# Altium schematic sheet Ethernet_Switch.SchDoc: =project_title
size Tabloid; CompanyName: Luxonis Holding; DrawnBy: Dan Dunga; Organization: Luxonis Holding; Address1: 1925 Harmony Park Drive; Address2: Westminster, CO; Address3: 80234; Address4: United States; SheetNumber: 8; SheetTotal: 15
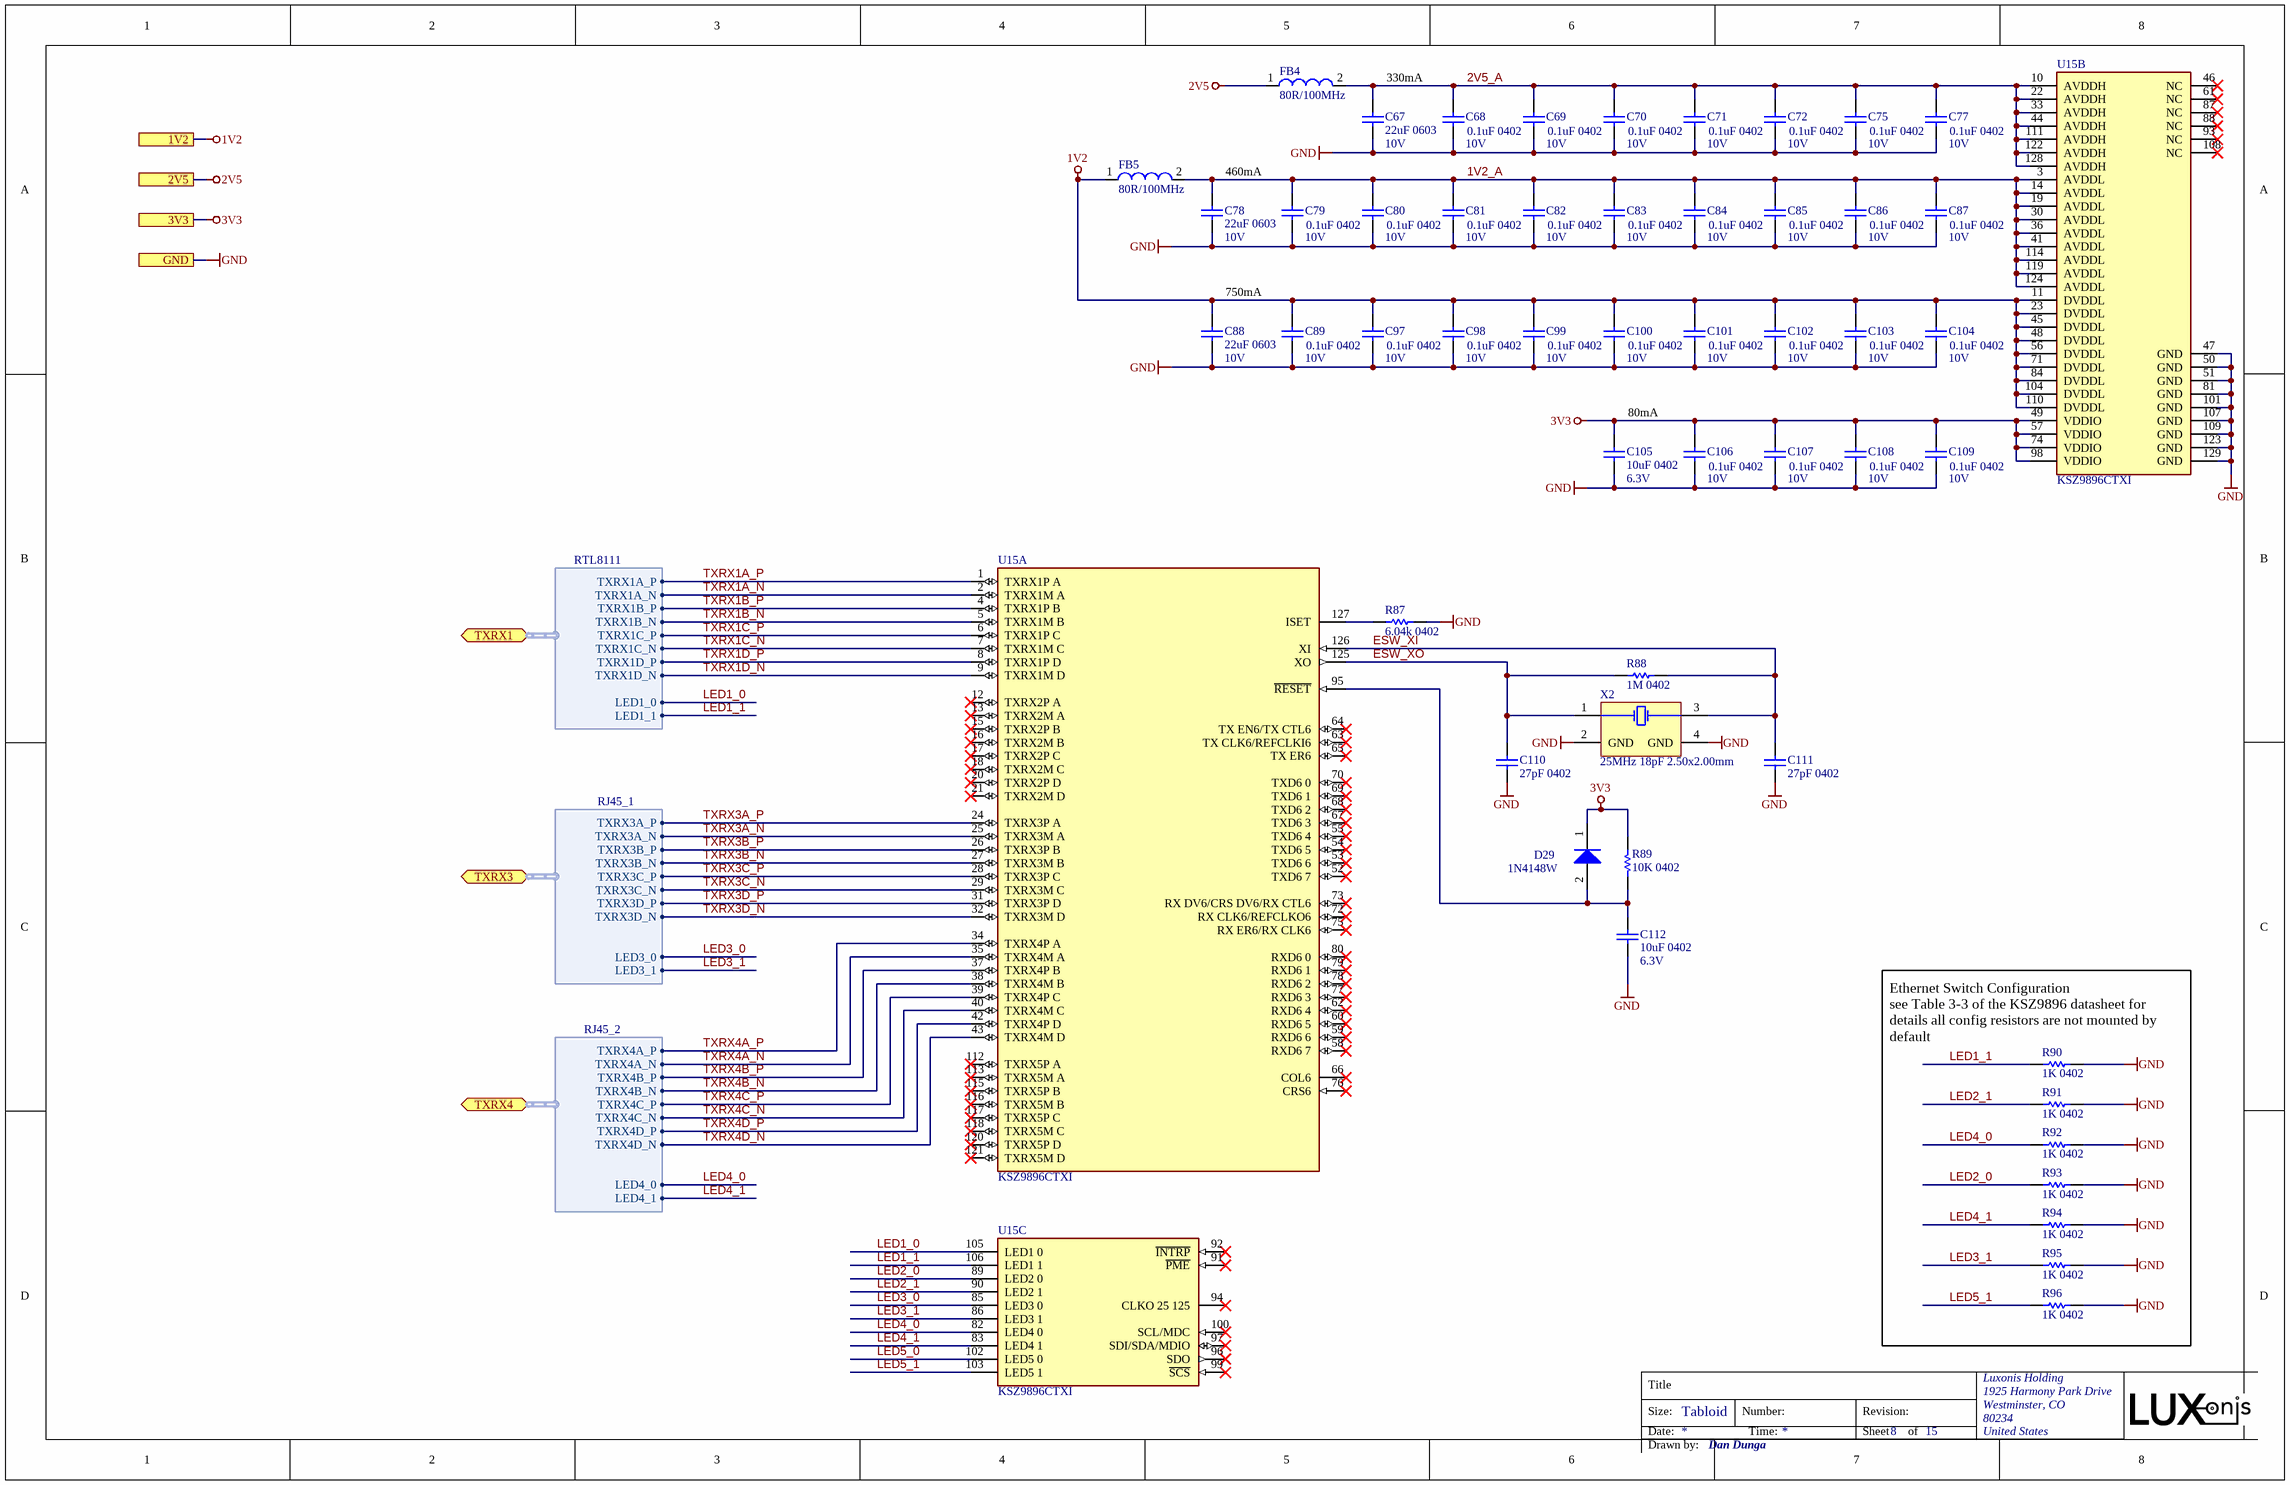
[diagram p0: Ethernet_Switch.SchDoc]

## Parts
C67  22uF 0603  Voltage Rating: 10V  [CAPC0603(1608)100_N]
C68  0.1uF 0402  Voltage Rating: 10V  [CAPC0402(1005)70_N]
C69  0.1uF 0402  Voltage Rating: 10V  [CAPC0402(1005)70_N]
C70  0.1uF 0402  Voltage Rating: 10V  [CAPC0402(1005)70_N]
C71  0.1uF 0402  Voltage Rating: 10V  [CAPC0402(1005)70_N]
C72  0.1uF 0402  Voltage Rating: 10V  [CAPC0402(1005)70_N]
C75  0.1uF 0402  Voltage Rating: 10V  [CAPC0402(1005)70_N]
C77  0.1uF 0402  Voltage Rating: 10V  [CAPC0402(1005)70_N]
C78  22uF 0603  Voltage Rating: 10V  [CAPC0603(1608)100_N]
C79  0.1uF 0402  Voltage Rating: 10V  [CAPC0402(1005)70_N]
C80  0.1uF 0402  Voltage Rating: 10V  [CAPC0402(1005)70_N]
C81  0.1uF 0402  Voltage Rating: 10V  [CAPC0402(1005)70_N]
C82  0.1uF 0402  Voltage Rating: 10V  [CAPC0402(1005)70_N]
C83  0.1uF 0402  Voltage Rating: 10V  [CAPC0402(1005)70_N]
C84  0.1uF 0402  Voltage Rating: 10V  [CAPC0402(1005)70_N]
C85  0.1uF 0402  Voltage Rating: 10V  [CAPC0402(1005)70_N]
C86  0.1uF 0402  Voltage Rating: 10V  [CAPC0402(1005)70_N]
C87  0.1uF 0402  Voltage Rating: 10V  [CAPC0402(1005)70_N]
C88  22uF 0603  Voltage Rating: 10V  [CAPC0603(1608)100_N]
C89  0.1uF 0402  Voltage Rating: 10V  [CAPC0402(1005)70_N]
C97  0.1uF 0402  Voltage Rating: 10V  [CAPC0402(1005)70_N]
C98  0.1uF 0402  Voltage Rating: 10V  [CAPC0402(1005)70_N]
C99  0.1uF 0402  Voltage Rating: 10V  [CAPC0402(1005)70_N]
C100  0.1uF 0402  Voltage Rating: 10V  [CAPC0402(1005)70_N]
C101  0.1uF 0402  Voltage Rating: 10V  [CAPC0402(1005)70_N]
C102  0.1uF 0402  Voltage Rating: 10V  [CAPC0402(1005)70_N]
C103  0.1uF 0402  Voltage Rating: 10V  [CAPC0402(1005)70_N]
C104  0.1uF 0402  Voltage Rating: 10V  [CAPC0402(1005)70_N]
C105  10uF 0402  Voltage Rating: 6.3V  [CAPC0402(1005)70_N]
C106  0.1uF 0402  Voltage Rating: 10V  [CAPC0402(1005)70_N]
C107  0.1uF 0402  Voltage Rating: 10V  [CAPC0402(1005)70_N]
C108  0.1uF 0402  Voltage Rating: 10V  [CAPC0402(1005)70_N]
C109  0.1uF 0402  Voltage Rating: 10V  [CAPC0402(1005)70_N]
C110  27pF 0402  [CAPC0402(1005)60_N]
C111  27pF 0402  [CAPC0402(1005)60_N]
C112  10uF 0402  Voltage Rating: 6.3V  [CAPC0402(1005)70_N]
D29  1N4148W  [1N4148W-7-F]
FB4  80R/100MHz  [BK1608HS800-T_N]
FB5  80R/100MHz  [BK1608HS800-T_N]
R87  6.04k 0402  [RESC0402(1005)_L]
R88  1M 0402  [RESC0402(1005)_N]
R89  10K 0402  [RESC0402(1005)_N]
R90  1K 0402  [RESC0402(1005)_N]
R91  1K 0402  [RESC0402(1005)_N]
R92  1K 0402  [RESC0402(1005)_N]
R93  1K 0402  [RESC0402(1005)_N]
R94  1K 0402  [RESC0402(1005)_N]
R95  1K 0402  [RESC0402(1005)_N]
R96  1K 0402  [RESC0402(1005)_N]
U15  KSZ9896CTXI  [FP-C04-418-IPC_A]  (parts A,B,C of 3)
X2  25MHz 18pF 2.50x2.00mm  [ECS-250-18-36B-CKY-TR]

## Ports
1V2, 2V5, 3V3, GND, TXRX1 (bidir, harness RTL8111), TXRX3 (bidir, harness RJ45_1), TXRX4 (bidir, harness RJ45_2)

## Harnesses
RTL8111: TXRX1A_P, TXRX1A_N, TXRX1B_P, TXRX1B_N, TXRX1C_P, TXRX1C_N, TXRX1D_P, TXRX1D_N, LED1_0, LED1_1
RJ45_1: TXRX3A_P, TXRX3A_N, TXRX3B_P, TXRX3B_N, TXRX3C_P, TXRX3C_N, TXRX3D_P, TXRX3D_N, LED3_0, LED3_1
RJ45_2: TXRX4A_P, TXRX4A_N, TXRX4B_P, TXRX4B_N, TXRX4C_P, TXRX4C_N, TXRX4D_P, TXRX4D_N, LED4_0, LED4_1

## Nets
1V2: C88.2 C89.2 C97.2 C98.2 C99.2 C100.2 C101.2 C102.2 C103.2 C104.2 FB5.1 U15.11(DVDDL) U15.23(DVDDL) U15.45(DVDDL) U15.48(DVDDL) U15.56(DVDDL) U15.71(DVDDL) U15.84(DVDDL) U15.104(DVDDL) U15.110(DVDDL) ; port 1V2
2V5: FB4.1 ; port 2V5
3V3: C105.2 C106.2 C107.2 C108.2 C109.2 D29.1(K) R89.1 U15.49(VDDIO) U15.57(VDDIO) U15.74(VDDIO) U15.98(VDDIO) ; port 3V3
GND: C67.1 C68.1 C69.1 C70.1 C71.1 C72.1 C75.1 C77.1 C78.1 C79.1 C80.1 C81.1 C82.1 C83.1 C84.1 C85.1 C86.1 C87.1 C88.1 C89.1 C97.1 C98.1 C99.1 C100.1 C101.1 C102.1 C103.1 C104.1 C105.1 C106.1 C107.1 C108.1 C109.1 C110.1 C111.1 C112.1 R87.2 R90.1 R91.1 R92.1 R93.1 R94.1 R95.1 R96.1 U15.47(GND) U15.50(GND) U15.51(GND) U15.81(GND) U15.101(GND) U15.107(GND) U15.109(GND) U15.123(GND) U15.129(GND) X2.2(GND) X2.4(GND) ; port GND
1V2_A: C78.2 C79.2 C80.2 C81.2 C82.2 C83.2 C84.2 C85.2 C86.2 C87.2 FB5.2 U15.3(AVDDL) U15.14(AVDDL) U15.19(AVDDL) U15.30(AVDDL) U15.36(AVDDL) U15.41(AVDDL) U15.114(AVDDL) U15.119(AVDDL) U15.124(AVDDL)
2V5_A: C67.2 C68.2 C69.2 C70.2 C71.2 C72.2 C75.2 C77.2 FB4.2 U15.10(AVDDH) U15.22(AVDDH) U15.33(AVDDH) U15.44(AVDDH) U15.111(AVDDH) U15.122(AVDDH) U15.128(AVDDH)
ESW_XI: C111.2 R88.2 U15.126(XI) X2.3(X2)
ESW_XO: C110.2 R88.1 U15.125(XO) X2.1(X1)
LED1_0: U15.105(LED1_0) ; port TXRX1.LED1_0
LED1_1: R90.2 U15.106(LED1_1) ; port TXRX1.LED1_1
LED2_0: R93.2 U15.89(LED2_0)
LED2_1: R91.2 U15.90(LED2_1)
LED3_0: U15.85(LED3_0) ; port TXRX3.LED3_0
LED3_1: R95.2 U15.86(LED3_1) ; port TXRX3.LED3_1
LED4_0: R92.2 U15.82(LED4_0) ; port TXRX4.LED4_0
LED4_1: R94.2 U15.83(LED4_1) ; port TXRX4.LED4_1
LED5_0: U15.102(LED5_0)
LED5_1: R96.2 U15.103(LED5_1)
TXRX1A_N: U15.2(TXRX1M_A) ; port TXRX1.TXRX1A_N
TXRX1A_P: U15.1(TXRX1P_A) ; port TXRX1.TXRX1A_P
TXRX1B_N: U15.5(TXRX1M_B) ; port TXRX1.TXRX1B_N
TXRX1B_P: U15.4(TXRX1P_B) ; port TXRX1.TXRX1B_P
TXRX1C_N: U15.7(TXRX1M_C) ; port TXRX1.TXRX1C_N
TXRX1C_P: U15.6(TXRX1P_C) ; port TXRX1.TXRX1C_P
TXRX1D_N: U15.9(TXRX1M_D) ; port TXRX1.TXRX1D_N
TXRX1D_P: U15.8(TXRX1P_D) ; port TXRX1.TXRX1D_P
TXRX3A_N: U15.25(TXRX3M_A) ; port TXRX3.TXRX3A_N
TXRX3A_P: U15.24(TXRX3P_A) ; port TXRX3.TXRX3A_P
TXRX3B_N: U15.27(TXRX3M_B) ; port TXRX3.TXRX3B_N
TXRX3B_P: U15.26(TXRX3P_B) ; port TXRX3.TXRX3B_P
TXRX3C_N: U15.29(TXRX3M_C) ; port TXRX3.TXRX3C_N
TXRX3C_P: U15.28(TXRX3P_C) ; port TXRX3.TXRX3C_P
TXRX3D_N: U15.32(TXRX3M_D) ; port TXRX3.TXRX3D_N
TXRX3D_P: U15.31(TXRX3P_D) ; port TXRX3.TXRX3D_P
TXRX4A_N: U15.35(TXRX4M_A) ; port TXRX4.TXRX4A_N
TXRX4A_P: U15.34(TXRX4P_A) ; port TXRX4.TXRX4A_P
TXRX4B_N: U15.38(TXRX4M_B) ; port TXRX4.TXRX4B_N
TXRX4B_P: U15.37(TXRX4P_B) ; port TXRX4.TXRX4B_P
TXRX4C_N: U15.40(TXRX4M_C) ; port TXRX4.TXRX4C_N
TXRX4C_P: U15.39(TXRX4P_C) ; port TXRX4.TXRX4C_P
TXRX4D_N: U15.43(TXRX4M_D) ; port TXRX4.TXRX4D_N
TXRX4D_P: U15.42(TXRX4P_D) ; port TXRX4.TXRX4D_P
NetC112_2: C112.2 D29.2(A) R89.2 U15.95(~{RESET})
NetR87_1: R87.1 U15.127(ISET)

Not connected (* = marked no-connect by the designer): U15 12(TXRX2P_A)* 13(TXRX2M_A)* 15(TXRX2P_B)* 16(TXRX2M_B)* 17(TXRX2P_C)* 18(TXRX2M_C)* 20(TXRX2P_D)* 21(TXRX2M_D)* 46(NC)* 52(TXD6_7)* 53(TXD6_6)* 54(TXD6_5)* 55(TXD6_4)* 58(RXD6_7)* 59(RXD6_6)* 60(RXD6_5)* 61(NC)* 62(RXD6_4)* 63(TX_CLK6/REFCLKI6)* 64(TX_EN6/TX_CTL6)* 65(TX_ER6)* 66(COL6)* 67(TXD6_3)* 68(TXD6_2)* 69(TXD6_1)* 70(TXD6_0)* 72(RX_CLK6/REFCLKO6)* 73(RX_DV6/CRS_DV6/RX_CTL6)* 75(RX_ER6/RX_CLK6)* 76(CRS6)* 77(RXD6_3)* 78(RXD6_2)* 79(RXD6_1)* 80(RXD6_0)* 87(NC)* 88(NC)* 91(~{PME})* 92(~{INTRP})* 93(NC)* 94(CLKO_25_125)* 96(SDO)* 97(SDI/SDA/MDIO)* 99(~{SCS})* 100(SCL/MDC)* 108(NC)* 112(TXRX5P_A)* 113(TXRX5M_A)* 115(TXRX5P_B)* 116(TXRX5M_B)* 117(TXRX5P_C)* 118(TXRX5M_C)* 120(TXRX5P_D)* 121(TXRX5M_D)*

## Notes on the sheet
- 330mA
- 460mA
- 750mA
- (near C105) 80mA
- (near R90) Ethernet Switch Configuration
  see Table 3-3 of the KSZ9896 datasheet for details all config resistors are not mounted by default
- Title
- Size:
- Date:
- Tabloid
- Number:
- Time:
- Revision:
- Sheet
- of
- Drawn by:

## Library data of the parts
C67 C78 C88 = GRM188R61A226ME15D: CAP CER 22UF 10V X5R 0603 20%; Manufacturer 1: Murata; Material: Ceramic; ComponentLink1URL: https://datasheet.ciiva.com/46444/1769893-46444975.pdf?src-supplier=Element14; ComponentLink1Description: https://datasheet.ciiva.com/46444/1769893-46444975.pdf?src-supplier=Element14; Supplier 1: Digi-Key; Manufacturer Part Number 1: GRM188R61A226ME15D; Stock 1: 984716; Pricing 1: 1=0.31000, 10=0.21500, 100=0.12160, 500=0.08584, 1000=0.07512 (USD); RoHS: Yes; Mount: Surface Mount; Case/Package: 0603; Weight: 0.000222oz; Case Code (Metric): 1608; Case Code (Imperial): 0603; Min Operating Temperature: -55°C; Max Operating Temperature: 85°C; Capacitance: 22uF; Tolerance: 20%; Packaging: Tape and Reel; Dielectric: X5R; Voltage Rating (DC): 10V; Termination: SMD/SMT; Package Quantity: 4000; Length: 1.6mm; Height: 0.8mm; Width: 0.8mm; Thickness: 0.039inch; Depth: 0.8mm; REACH SVHC: No SVHC; Lead Free: Lead Free; Supplier Part Number 1: 490-10476-1-ND
C68-C72 C75 C77 C79-C87 C89 C97-C104 C106-C109 = GRM155R71A104JA01D: CAP CER 0.1UF 10V X7R 0402 5%; Manufacturer 1: Murata; Capacitance: 100nF; Supplier 1: Digi-Key; Manufacturer Part Number 1: GRM155R71A104JA01D; Stock 1: 1346709; Pricing 1: 1=0.10000, 10=0.02500, 100=0.01130, 500=0.00806, 1000=0.00633, 2500=0.00575, 5000=0.00529 (USD); RoHS: Yes; Mount: Surface Mount; Case/Package: 0402; Case Code (Imperial): 0402; Case Code (Metric): 1005; Min Operating Temperature: -55°C; Max Operating Temperature: 125°C; Tolerance: 5%; Packaging: Tape and Reel; Voltage Rating (DC): 10V; Dielectric: X7R; Package Quantity: 10000; Termination: SMD/SMT; Length: 1mm; Height: 0.5mm; Width: 0.02inch; Thickness: 0.022inch; Depth: 0.5mm; Radiation Hardening: No; Lead Free: Lead Free; ComponentLink1URL: https://datasheet.ciiva.com/5411/product-5411135.pdf?src-supplier=Mouser; ComponentLink1Description: https://datasheet.ciiva.com/5411/product-5411135.pdf?src-supplier=Mouser; ComponentLink2URL: https://datasheet.ciiva.com/11618/c02e-11618821.pdf?src-supplier=Avnet; ComponentLink2Description: https://datasheet.ciiva.com/11618/c02e-11618821.pdf?src-supplier=Avnet; Supplier Part Number 1: 490-10777-1-ND
C105 C112 = GRM155R60J106ME15D: CAP CER 10UF 6.3V X5R 0402 20%; Manufacturer 1: Murata; Supplier 1: Digi-Key; Manufacturer Part Number 1: GRM155R60J106ME15D; Stock 1: 1839627; Pricing 1: 1=0.23000, 10=0.15700, 100=0.07950, 500=0.05442, 1000=0.04814, 2500=0.04605, 5000=0.04186 (USD); RoHS: Yes; Mount: Surface Mount; Case/Package: 0402; Case Code (Metric): 1005; Case Code (Imperial): 0402; Min Operating Temperature: -55°C; Max Operating Temperature: 85°C; Packaging: Tape and Reel; Capacitance: 10uF; Dielectric: X5R; Length: 0.039inch; Width: 0.02inch; ComponentLink1URL: https://www.murata.com/~/media/webrenewal/support/library/catalog/products/capacitor/mlcc/c02e.ashx?la=en-us&src-supplier=Digi-Key; ComponentLink1Description: https://www.murata.com/~/media/webrenewal/support/library/catalog/products/capacitor/mlcc/c02e.ashx?la=en-us&src-supplier=Digi-Key; Supplier Part Number 1: 490-13238-1-ND; Voltage Rating (DC): 6.3V; Thickness: 0.026inch; Tolerance: 20%
C110 C111 = C0402C270J5GACTU: CAP CER 27PF 50V C0G/NP0 0402; Manufacturer 1: KEMET; Dielectric Material: Ceramic; Tolerance: 5%; Dielectric: C0G; Temperature Coefficient: 30ppm/°C; Supplier 1: Digi-Key; Manufacturer Part Number 1: C0402C270J5GACTU; RoHS: Yes; Category: Ceramic Capacitors; Stock 1: 1799770; Pricing 1: 1=0.10000, 10=0.03500, 100=0.01580, 500=0.01128, 1000=0.00886, 2500=0.00805, 5000=0.00741 (USD); Mount: Surface Mount,PCB; Case/Package: 0402; Number of Pins: 2; Weight: 2.3E-05oz; Case Code (Metric): 1005; Case Code (Imperial): 0402; Contact Plating: Tin,Matte; Min Operating Temperature: -55°C; Max Operating Temperature: 125°C; Capacitance: 27pF; Packaging: Tape and Reel; Voltage Rating (DC): 50V; Package Quantity: 1; Termination: SMD/SMT; Voltage Rating: 50V; Voltage: 50V; Length: 1mm; Height: 0.5mm; Width: 0.5mm; Depth: 0.5mm; Thickness: 0.022inch; Radiation Hardening: No; Lead Free: Lead Free; REACH SVHC: No SVHC; ComponentLink1URL: https://datasheet.ciiva.com/144/docfinderpartnumber-c0402c270j5gactu-144118.pdf?src-supplier=Digi-Key; ComponentLink1Description: https://datasheet.ciiva.com/144/docfinderpartnumber-c0402c270j5gactu-144118.pdf?src-supplier=Digi-Key; ComponentLink2URL: https://datasheet.ciiva.com/7747/kem-c1003-c0g-smd-7747509.pdf?src-supplier=Element14; ComponentLink2Description: https://datasheet.ciiva.com/7747/kem-c1003-c0g-smd-7747509.pdf?src-supplier=Element14; ComponentLink3URL: https://datasheet.ciiva.com/26847/getdatasheetpartid-408632-26847386.pdf?src-supplier=Verical; ComponentLink3Description: https://datasheet.ciiva.com/26847/getdatasheetpartid-408632-26847386.pdf?src-supplier=Verical; ComponentLink4URL: https://datasheet.ciiva.com/7392/1372242-7392237.pdf?src-supplier=Newark; ComponentLink4Description: https://datasheet.ciiva.com/7392/1372242-7392237.pdf?src-supplier=Newark; ComponentLink5URL: https://datasheet.ciiva.com/14586/70095383-14586671.pdf?src-supplier=Allied+Electronics; ComponentLink5Description: https://datasheet.ciiva.com/14586/70095383-14586671.pdf?src-supplier=Allied+Electronics; Supplier 2: Newark; Supplier 3: Mouser; Supplier Part Number 1: 399-1016-1-ND; Supplier Part Number 2: 53M7161; Supplier Part Number 3: 80-C0402C270J5G
D29 = 1N4148W-7-F: DIODE GEN PURP 100V 300MA SOD123; Manufacturer 1: Diodes; Element Configuration: Single; Forward Current: 150mA; Forward Voltage: 1.25V; Reverse Recovery Time: 4ns; Peak Non-Repetitive Surge Current: 2A; Peak Reverse Current: 1uA; Power Dissipation: 400mW; Polarity: Standard; Voltage Rating (DC): 75V; Capacitance: 2pF; Current: 15A; Supplier 1: Digi-Key; Manufacturer Part Number 1: 1N4148W-7-F; Stock 1: 5430248; Pricing 1: 1=0.16000, 10=0.15000, 100=0.06290, 500=0.04942, 1000=0.03432 (USD); RoHS: Yes; Mount: Surface Mount; Number of Pins: 2; Weight: 0.000353oz; Contact Plating: Tin,Matte; Min Operating Temperature: -65°C; Max Operating Temperature: 150°C; Packaging: Tape and Reel; Package Quantity: 3000; Max Repetitive Reverse Voltage (Vrrm): 100V; Recovery Time: 4ns; Average Rectified Current: 300mA; Max Reverse Voltage (DC): 100V; Max Surge Current: 2A; Max Forward Surge Current (Ifsm): 2A; Power Rating: 400mW; Current Rating: 150mA; Output Current: 150mA; Voltage: 100V; Length: 2.85mm; Height: 1.25mm; Width: 1.7mm; Radiation Hardening: No; Lead Free: Lead Free; REACH SVHC: No SVHC; ComponentLink1URL: https://datasheet.ciiva.com/4435/ds30086-4435128.pdf?src-supplier=Mouser; ComponentLink1Description: https://datasheet.ciiva.com/4435/ds30086-4435128.pdf?src-supplier=Mouser; ComponentLink2URL: https://datasheet.ciiva.com/8300/ds30086-8300392.pdf?src-supplier=Avnet; ComponentLink2Description: https://datasheet.ciiva.com/8300/ds30086-8300392.pdf?src-supplier=Avnet; ComponentLink3URL: https://datasheet.ciiva.com/911/ds30086-911734.pdf?src-supplier=Digi-Key; ComponentLink3Description: https://datasheet.ciiva.com/911/ds30086-911734.pdf?src-supplier=Digi-Key; ComponentLink4URL: https://datasheet.ciiva.com/911/ds30086-911735.pdf?src-supplier=Digi-Key; ComponentLink4Description: https://datasheet.ciiva.com/911/ds30086-911735.pdf?src-supplier=Digi-Key; ComponentLink5URL: https://datasheet.ciiva.com/22695/1915529-22695239.pdf?src-supplier=Element14; ComponentLink5Description: https://datasheet.ciiva.com/22695/1915529-22695239.pdf?src-supplier=Element14; ComponentLink6URL: https://datasheet.ciiva.com/911/ds30086-911736.pdf?src-supplier=Digi-Key; ComponentLink6Description: https://datasheet.ciiva.com/911/ds30086-911736.pdf?src-supplier=Digi-Key; ComponentLink7URL: https://datasheet.ciiva.com/1179/1915529-1179304.pdf?src-supplier=Element14; ComponentLink7Description: https://datasheet.ciiva.com/1179/1915529-1179304.pdf?src-supplier=Element14; ComponentLink8URL: https://datasheet.ciiva.com/25919/ds30086-25919609.pdf?src-supplier=Avnet+Europe; ComponentLink8Description: https://datasheet.ciiva.com/25919/ds30086-25919609.pdf?src-supplier=Avnet+Europe; ComponentLink9URL: https://datasheet.ciiva.com/15219/getdatasheetpartid-110030-15219548.pdf?src-supplier=Verical; ComponentLink9Description: https://datasheet.ciiva.com/15219/getdatasheetpartid-110030-15219548.pdf?src-supplier=Verical; ComponentLink10URL: https://datasheet.ciiva.com/8303/ds30086-8303197.pdf?src-supplier=Avnet; ComponentLink10Description: https://datasheet.ciiva.com/8303/ds30086-8303197.pdf?src-supplier=Avnet; Supplier 2: Newark; Supplier 3: Mouser; Supplier Part Number 1: 1N4148W-FDICT-ND; Supplier Part Number 2: 52R3924; Supplier Part Number 3: 621-1N4148W-F
FB4 FB5 = BK1608HS800-T: FERRITE BEAD 80 OHM 0603 1LN; Manufacturer 1: Taiyo Yuden; Impedance: 80R; Tolerance: 25%; Max DC Current: 600mA; DC Resistance (DCR): 100mR; Test Frequency: 100MHz; Number of Lines: 1; Shielding: Shielded; Supplier 1: Digi-Key; Manufacturer Part Number 1: BK1608HS800-T; Stock 1: 6285; Pricing 1: 1=0.10000, 10=0.07900, 25=0.07200, 50=0.06480, 100=0.04760, 250=0.03460, 500=0.03170, 1000=0.02738 (USD); RoHS: Yes; Mount: Surface Mount; Case/Package: 0603; Number of Pins: 2; Core Material: Ferrite; Case Code (Metric): 1608; Case Code (Imperial): 0603; Min Operating Temperature: -55°C; Max Operating Temperature: 125°C; Package Quantity: 1; Packaging: Tape and Reel; Termination: SMD/SMT; Max Current Rating: 600mA; Frequency: 100MHz; Length: 0.063inch; Height: 0.037inch; Width: 0.8mm; Depth: 0.95mm; REACH SVHC: Unknown; Lead Free: Lead Free; Halogen Free: Halogen Free; ComponentLink1URL: https://datasheet.ciiva.com/1011/bk1608hs800-t-ss-1011885.pdf?src-supplier=Digi-Key; ComponentLink1Description: https://datasheet.ciiva.com/1011/bk1608hs800-t-ss-1011885.pdf?src-supplier=Digi-Key; ComponentLink2URL: https://datasheet.ciiva.com/1011/mlci07-e-1011886.pdf?src-supplier=Digi-Key; ComponentLink2Description: https://datasheet.ciiva.com/1011/mlci07-e-1011886.pdf?src-supplier=Digi-Key; ComponentLink3URL: https://datasheet.ciiva.com/1011/mlci07-e-1011887.pdf?src-supplier=Digi-Key; ComponentLink3Description: https://datasheet.ciiva.com/1011/mlci07-e-1011887.pdf?src-supplier=Digi-Key; Supplier 2: Mouser; Supplier 3: Arrow; Supplier Part Number 1: 587-1875-1-ND; Supplier Part Number 2: 963-BK1608HS800-T; Supplier Part Number 3: BK1608HS800-T
R87 = CRCW04026K04FKED: Res Thick Film 0402 6.04K Ohm 1% 0.063W(1/16W) ±100ppm/C Molded SMD Automotive Paper T/R; Manufacturer 1: Vishay; Manufacturer Part Number 1: CRCW04026K04FKEDC; Resistance: 6.04kR; Temperature Coefficient: 100ppm/°C; Max Power Dissipation: 63mW; Voltage Rating (DC): 50V; RoHS: Yes; Category: Chip SMD Resistors; Stock 1: 15940; Pricing 1: 1=0.12500, 25=0.04100, 100=0.01800, 250=0.01400, 500=0.01100, 1000=0.00800 (USD); Case/Package: 0402; Number of Pins: 2; Case Code (Metric): 1005; Case Code (Imperial): 0402; Contact Plating: Tin; Weight: 2.3E-05oz; Size Code: 0402; Min Operating Temperature: -55°C; Max Operating Temperature: 155°C; Tolerance: 1%; Packaging: Tape and Reel; Resistor Type: Thick Film; Number of Terminations: 2; Series: CRCW; Power Rating: 63mW; Package Quantity: 10; Voltage Rating: 50V; Termination: SMD/SMT; Features: Automotive AEC-Q200; Technology: THICK FILM; Construction: Rectangular; Resistance Tolerance: 1%; Length: 1mm; Width: 0.02inch; Height: 0.35mm; Depth: 0.5mm; Radiation Hardening: No; RoHS Compliant: Yes; Lead Free: Lead Free; Military Standard: Not; REACH SVHC: Unknown; ComponentLink1URL: https://datasheet.ciiva.com/11810/0900766b80d98824-11810128.pdf?src-supplier=RSComponents; ComponentLink1Description: https://datasheet.ciiva.com/11810/0900766b80d98824-11810128.pdf?src-supplier=RSComponents; ComponentLink2URL: https://datasheet.ciiva.com/16426/dcrcwe3-16426295.pdf?src-supplier=Future+Electronics; ComponentLink2Description: https://datasheet.ciiva.com/16426/dcrcwe3-16426295.pdf?src-supplier=Future+Electronics; ComponentLink3URL: https://datasheet.ciiva.com/7172/1533075-7172984.pdf?src-supplier=Newark; ComponentLink3Description: https://datasheet.ciiva.com/7172/1533075-7172984.pdf?src-supplier=Newark; ComponentLink4URL: https://datasheet.ciiva.com/3256/dcrcwe3-3256762.pdf?src-supplier=Avnet; ComponentLink4Description: https://datasheet.ciiva.com/3256/dcrcwe3-3256762.pdf?src-supplier=Avnet; ComponentLink5URL: https://datasheet.ciiva.com/3256/dcrcwe3-3256763.pdf?src-supplier=Avnet; ComponentLink5Description: https://datasheet.ciiva.com/3256/dcrcwe3-3256763.pdf?src-supplier=Avnet; ComponentLink6URL: https://datasheet.ciiva.com/2463/dcrcwe3-2463148.pdf?src-supplier=Digi-Key; ComponentLink6Description: https://datasheet.ciiva.com/2463/dcrcwe3-2463148.pdf?src-supplier=Digi-Key; ComponentLink7URL: https://datasheet.ciiva.com/2463/dcrcwe3-2463149.pdf?src-supplier=Digi-Key; ComponentLink7Description: https://datasheet.ciiva.com/2463/dcrcwe3-2463149.pdf?src-supplier=Digi-Key; ComponentLink8URL: https://datasheet.ciiva.com/5542/dcrcwe3-109170-5542221.pdf?src-supplier=Mouser; ComponentLink8Description: https://datasheet.ciiva.com/5542/dcrcwe3-109170-5542221.pdf?src-supplier=Mouser; ComponentLink9URL: https://datasheet.ciiva.com/2463/dcrcwe3-2463150.pdf?src-supplier=Digi-Key; ComponentLink9Description: https://datasheet.ciiva.com/2463/dcrcwe3-2463150.pdf?src-supplier=Digi-Key; Supplier 1: Digi-Key; Supplier Part Number 1: 541-6.04KLCT-ND; Supplier 2: Digi-Key; Supplier Part Number 2: 541-6.04KLTR-ND
R88 = RC0402FR-071ML: RES SMD 1M OHM 1% 1/16W 0402; Manufacturer 1: Yageo; Resistance: 1MR; Temperature Coefficient: 100ppm/°C; Power Rating: 63mW; Voltage Rating: 50V; Manufacturer Part Number 1: RC0402FR-071ML; Supplier 1: Digi-Key; Stock 1: 11406681; Pricing 1: 1=0.10000, 10=0.01500, 100=0.00600, 1000=0.00268, 2500=0.00232, 5000=0.00192 (USD); RoHS: Yes; Case/Package: 0402; Case Code (Imperial): 0402; Case Code (Metric): 1005; Min Operating Temperature: -55°C; Max Operating Temperature: 155°C; Packaging: Tape and Reel; Tolerance: 1%; Composition: Thick Film; Military Standard: Not; Termination: SMD/SMT; Length: 1mm; Height: 0.32mm; Depth: 0.5mm; Lead Free: Lead Free; REACH SVHC: Unknown; ComponentLink1URL: https://datasheet.ciiva.com/11808/0900766b80c66297-11808125.pdf?src-supplier=RSComponents; ComponentLink1Description: https://datasheet.ciiva.com/11808/0900766b80c66297-11808125.pdf?src-supplier=RSComponents; ComponentLink2URL: https://datasheet.ciiva.com/46394/1018594-46394951.pdf?src-supplier=Element14; ComponentLink2Description: https://datasheet.ciiva.com/46394/1018594-46394951.pdf?src-supplier=Element14; ComponentLink3URL: https://datasheet.ciiva.com/16741/pyu-rc0402-51-rohs-l-6-r-16741081.pdf?src-supplier=Future+Electronics; ComponentLink3Description: https://datasheet.ciiva.com/16741/pyu-rc0402-51-rohs-l-6-r-16741081.pdf?src-supplier=Future+Electronics; ComponentLink4URL: https://datasheet.ciiva.com/7849/1018594-7849882.pdf?src-supplier=Element14; ComponentLink4Description: https://datasheet.ciiva.com/7849/1018594-7849882.pdf?src-supplier=Element14; ComponentLink5URL: https://datasheet.ciiva.com/7849/1018594-7849883.pdf?src-supplier=Element14; ComponentLink5Description: https://datasheet.ciiva.com/7849/1018594-7849883.pdf?src-supplier=Element14; Supplier Part Number 1: 311-1.00MLRCT-ND; Supplier 2: Mouser; Supplier Part Number 2: 603-RC0402FR-071ML
R89 = RC0402FR-1310KL: RES SMD 10K OHM 1% 0402 1/16W Chip Resistor, 0402 [1005 Metric], 10 kohm, RC Series, 50 V, Thick Film, 62.5 mW; Manufacturer 1: Yageo; Resistance: 10kR; Temperature Coefficient: 100ppm/°C; Power Rating: 62.5mW; Voltage Rating: 50V; ComponentLink1URL: https://datasheet.ciiva.com/16940/pyu-rc0402-51-rohs-l-6-16940293.pdf?src-supplier=Avnet+Europe; ComponentLink1Description: https://datasheet.ciiva.com/16940/pyu-rc0402-51-rohs-l-6-16940293.pdf?src-supplier=Avnet+Europe; ComponentLink2URL: https://datasheet.ciiva.com/28386/pyu-rc0402-51-rohs-l-6-28386855.pdf?src-supplier=Avnet+Europe; ComponentLink2Description: https://datasheet.ciiva.com/28386/pyu-rc0402-51-rohs-l-6-28386855.pdf?src-supplier=Avnet+Europe; ComponentLink3URL: https://datasheet.ciiva.com/16740/pyu-rc0402-51-rohs-l-6-r-16740602.pdf?src-supplier=Future+Electronics; ComponentLink3Description: https://datasheet.ciiva.com/16740/pyu-rc0402-51-rohs-l-6-r-16740602.pdf?src-supplier=Future+Electronics; ComponentLink4URL: https://datasheet.ciiva.com/8891/pyu-rc0402-51-rohs-l-6-8891339.pdf?src-supplier=Avnet; ComponentLink4Description: https://datasheet.ciiva.com/8891/pyu-rc0402-51-rohs-l-6-8891339.pdf?src-supplier=Avnet; ComponentLink5URL: https://datasheet.ciiva.com/5557/pyu-rc0402-51-rohs-l-6-r-5557997.pdf?src-supplier=Mouser; ComponentLink5Description: https://datasheet.ciiva.com/5557/pyu-rc0402-51-rohs-l-6-r-5557997.pdf?src-supplier=Mouser; ComponentLink6URL: https://datasheet.ciiva.com/7983/1018594-7983533.pdf?src-supplier=Element14; ComponentLink6Description: https://datasheet.ciiva.com/7983/1018594-7983533.pdf?src-supplier=Element14; Supplier 1: Newark; Manufacturer Part Number 1: RC0402FR-1310KL; Stock 1: 62239; Pricing 1: 1=0.10000, 25=0.01200, 100=0.00400, 250=0.00400, 500=0.00300, 1000=0.00300 (USD); RoHS: Yes; Case/Package: 0402; Number of Pins: 2; Contact Plating: Tin,Matte,Lead; Case Code (Imperial): 0402; Case Code (Metric): 1005; Min Operating Temperature: -55°C; Max Operating Temperature: 155°C; Tolerance: 1%; Composition: Thick Film; Packaging: Tape and Reel; Termination: SMD/SMT; Military Standard: Not; Voltage Rating (DC): 50V; Working Voltage: 50V; Number of Terminations: 2; Length: 1mm; Depth: 0.5mm; Radiation Hardening: No; REACH SVHC: No SVHC; Lead Free: Lead Free; Supplier Part Number 1: 67R9960
R90-R96 = RC0402FR-071KL: RES SMD 1K OHM 1% 1/16W 0402 1 kOhms ±1% 0.063W, 1/16W Chip Resistor 0402 (1005 Metric) Moisture Resistant Thick Film; Manufacturer 1: Yageo; Temperature Coefficient: 100ppm/°C; Power Rating: 62.5mW; Voltage Rating (DC): 50V; Resistance: 1kR; RoHS: Yes; Number of Pins: 2; Case Code (Imperial): 0402; Case Code (Metric): 1005; Min Operating Temperature: -55°C; Max Operating Temperature: 155°C; Packaging: Tape and Reel; Composition: Thick Film; Voltage Rating: 50V; Military Standard: Not; Termination: SMD/SMT; Length: 1mm; Height: 0.32mm; Width: 0.5mm; Depth: 0.5mm; Lead Free: Lead Free; REACH SVHC: Unknown; ComponentLink1URL: https://datasheet.ciiva.com/11819/0900766b80c66297-11819477.pdf?src-supplier=RSComponents; ComponentLink1Description: https://datasheet.ciiva.com/11819/0900766b80c66297-11819477.pdf?src-supplier=RSComponents; ComponentLink2URL: https://datasheet.ciiva.com/12666/pyu-rc0402-51-rohs-l-6-r-12666741.pdf?src-supplier=Mouser; ComponentLink2Description: https://datasheet.ciiva.com/12666/pyu-rc0402-51-rohs-l-6-r-12666741.pdf?src-supplier=Mouser; ComponentLink3URL: https://datasheet.ciiva.com/17063/pyu-rc0402-51-rohs-l-6-r-17063193.pdf?src-supplier=Future+Electronics; ComponentLink3Description: https://datasheet.ciiva.com/17063/pyu-rc0402-51-rohs-l-6-r-17063193.pdf?src-supplier=Future+Electronics; ComponentLink4URL: https://datasheet.ciiva.com/22747/1018594-22747513.pdf?src-supplier=Element14; ComponentLink4Description: https://datasheet.ciiva.com/22747/1018594-22747513.pdf?src-supplier=Element14; ComponentLink5URL: https://datasheet.ciiva.com/7849/1018594-7849869.pdf?src-supplier=Element14; ComponentLink5Description: https://datasheet.ciiva.com/7849/1018594-7849869.pdf?src-supplier=Element14; ComponentLink6URL: https://datasheet.ciiva.com/7983/1018594-7983502.pdf?src-supplier=Element14; ComponentLink6Description: https://datasheet.ciiva.com/7983/1018594-7983502.pdf?src-supplier=Element14; ComponentLink7URL: https://datasheet.ciiva.com/7849/1018594-7849871.pdf?src-supplier=Element14; ComponentLink7Description: https://datasheet.ciiva.com/7849/1018594-7849871.pdf?src-supplier=Element14; Supplier 1: Digi-Key; Manufacturer Part Number 1: RC0402FR-071KL; Stock 1: 60695854; Pricing 1: 1=0.10000, 10=0.01600, 100=0.00670, 1000=0.00301, 2500=0.00261, 5000=0.00215 (USD); Case/Package: 0402; Tolerance: 1%; Supplier Part Number 1: 311-1.00KLRCT-ND
U15 = KSZ9896CTXI: MICROCHIP - KSZ9896CTXI - ETHERNET SWITCH, 1GBPS, -40 TO 85DEG C; Interface: I2C,SPI; Min Supply Voltage: -0.5V; Max Supply Voltage: 5V; Ethernet Bandwidth: 10/100/1000Mbps; Case/Package: TQFP; Min Operating Temperature: -40°C; Max Operating Temperature: 85°C; Packaging: Tray; ComponentLink1URL: http://www.farnell.com/datasheets/2793750.pdf?src-supplier=Farnell; ComponentLink1Description: http://www.farnell.com/datasheets/2793750.pdf?src-supplier=Farnell; ComponentLink2URL: http://ww1.microchip.com/downloads/en/devicedoc/00002390a.pdf?src-supplier=Digi-Key; ComponentLink2Description: http://ww1.microchip.com/downloads/en/devicedoc/00002390a.pdf?src-supplier=Digi-Key; ComponentLink3URL: http://www.farnell.com/datasheets/2793750.pdf?src-supplier=Newark; ComponentLink3Description: http://www.farnell.com/datasheets/2793750.pdf?src-supplier=Newark; Supplier 1: Digi-Key; Manufacturer 1: Microchip; RoHS: Yes; Category: Ethernet Interface ICs; Stock 1: 879; Pricing 1: 1=12.50000, 25=10.45200 (USD); Supplier Part Number 1: KSZ9896CTXI-ND; Manufacturer Part Number 1: KSZ9896CTXI; Number of Pins: 129; Weight: 0.557500g
X2 = ECS-250-18-36B-CKY-TR: CRYSTAL 25.0000MHZ 18PF SMD 25MHz ±10ppm Crystal 18pF 50 Ohms 4-SMD, No Lead; Manufacturer 1: ECS International; Supplier 1: Digi-Key; Manufacturer Part Number 1: ECS-250-18-36B-CKY-TR; RoHS: No; Stock 1: 1111; Pricing 1: 1=0.48000, 10=0.39900, 50=0.35880, 100=0.31900, 500=0.30306 (USD); Supplier 2: Mouser; Supplier 3: Arrow; Supplier Part Number 1: XC3051CT-ND; Supplier Part Number 2: 520-250-18-36B-CKYT; Supplier Part Number 3: ECS-250-18-36B-CKY-TR